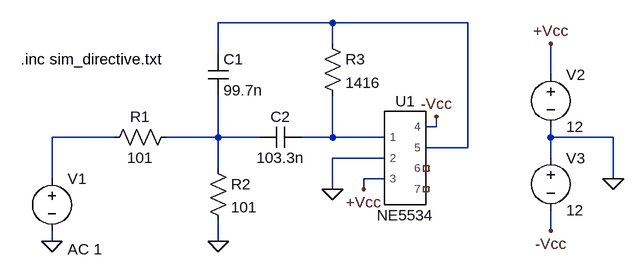
[diagram p0: schematic tplab1tc2_imp.asc]
tplab1tc2_imp.asc, the LTspice schematic file:
Version 4.1
SHEET 1 880 680
WIRE 288 -32 112 -32
WIRE 496 -32 288 -32
WIRE 288 0 288 -32
WIRE 112 16 112 -32
WIRE 624 48 624 0
WIRE 448 128 448 112
WIRE 448 128 432 128
WIRE -48 144 -144 144
WIRE 112 144 112 80
WIRE 112 144 32 144
WIRE 176 144 112 144
WIRE 288 144 288 80
WIRE 288 144 240 144
WIRE 368 144 288 144
WIRE 624 144 624 128
WIRE 720 144 624 144
WIRE 496 160 496 -32
WIRE 496 160 432 160
WIRE 368 176 288 176
WIRE 624 176 624 144
WIRE 112 192 112 144
WIRE -144 208 -144 144
WIRE 368 208 336 208
WIRE 720 208 720 144
WIRE 288 224 288 176
WIRE 336 224 336 208
WIRE 624 288 624 256
WIRE -144 304 -144 288
WIRE 112 304 112 272
FLAG 288 224 0
FLAG 112 304 0
FLAG -144 304 0
FLAG 720 208 0
FLAG 624 0 +Vcc
FLAG 336 224 +Vcc
FLAG 624 288 -Vcc
FLAG 448 112 -Vcc
SYMBOL res 48 128 R90
WINDOW 0 0 56 VBottom 2
WINDOW 3 32 56 VTop 2
SYMATTR InstName R1
SYMATTR Value 101
SYMBOL res 96 176 R0
SYMATTR InstName R2
SYMATTR Value 101
SYMBOL res 272 -16 R0
SYMATTR InstName R3
SYMATTR Value 1416
SYMBOL cap 96 16 R0
SYMATTR InstName C1
SYMATTR Value 99.7n
SYMBOL cap 240 128 R90
WINDOW 0 0 32 VBottom 2
WINDOW 3 32 32 VTop 2
SYMATTR InstName C2
SYMATTR Value 103.3n
SYMBOL voltage -144 192 R0
WINDOW 123 24 124 Left 2
WINDOW 39 0 0 Left 0
SYMATTR Value2 AC 1
SYMATTR InstName V1
SYMATTR Value ""
SYMBOL voltage 624 32 R0
WINDOW 123 0 0 Left 0
WINDOW 39 0 0 Left 0
SYMATTR InstName V2
SYMATTR Value 12
SYMBOL voltage 624 160 R0
WINDOW 123 0 0 Left 0
WINDOW 39 0 0 Left 0
SYMATTR InstName V3
SYMATTR Value 12
SYMBOL NE5534 400 176 R0
SYMATTR InstName U1
TEXT -192 24 Left 2 !.inc sim_directive.txt

The netlist it stands for:
* tplab1tc2_imp.asc
R1 N003 N002 101
R2 N003 0 101
R3 N001 N004 1416
C1 N001 N003 99.7n
C2 N004 N003 103.3n
V1 N002 0 AC 1
V2 +Vcc 0 12
V3 0 -Vcc 12
X§U1 N004 0 +Vcc -Vcc N001 NC_01 NC_02 NE5534  ; pins 1 2 3 4 5 6 7
.inc sim_directive.txt
.lib C:\users\julian\Documents\uni\tc2\repositorio\tp_lab_1\sim\NE5534.301
.backanno
.end